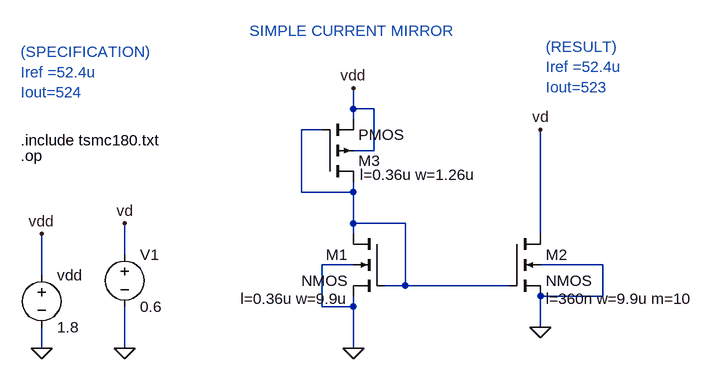
[diagram p0: schematic CurrentMirrorSimple -1.asc]
CurrentMirrorSimple -1.asc, the LTspice schematic file:
Version 4
SHEET 1 880 680
WIRE -16 0 -16 -32
WIRE 16 0 -16 0
WIRE -16 16 -16 0
WIRE -64 32 -96 32
WIRE 16 64 16 0
WIRE 16 64 -16 64
WIRE -96 128 -96 32
WIRE -16 128 -16 112
WIRE -16 128 -96 128
WIRE -16 176 -16 128
WIRE 64 176 -16 176
WIRE -16 192 -16 176
WIRE 272 192 272 32
WIRE -368 224 -368 176
WIRE -16 240 -64 240
WIRE 368 240 272 240
WIRE -496 256 -496 192
WIRE 64 272 64 176
WIRE 64 272 32 272
WIRE 224 272 64 272
WIRE 368 288 368 240
WIRE 368 288 272 288
WIRE -64 304 -64 240
WIRE -16 304 -16 288
WIRE -16 304 -64 304
WIRE 272 336 272 288
WIRE -496 368 -496 336
WIRE -368 368 -368 304
WIRE -16 368 -16 304
FLAG -16 368 0
FLAG -496 368 0
FLAG -496 192 vdd
FLAG -16 -32 vdd
FLAG 272 336 0
FLAG -368 176 vd
FLAG -368 368 0
FLAG 272 32 vd
SYMBOL nmos4 32 192 M0
WINDOW 123 56 100 Left 2
SYMATTR Value2 l=0.36u w=9.9u
SYMATTR InstName M1
SYMBOL voltage -496 240 R0
WINDOW 123 0 0 Left 0
WINDOW 39 0 0 Left 0
SYMATTR InstName vdd
SYMATTR Value 1.8
SYMBOL nmos4 224 192 R0
WINDOW 123 56 100 Left 2
SYMATTR Value2 l=360n w=9.9u m=10
SYMATTR InstName M2
SYMBOL voltage -368 208 R0
WINDOW 123 0 0 Left 0
WINDOW 39 0 0 Left 0
SYMATTR InstName V1
SYMATTR Value 0.6
SYMBOL pmos4 -64 112 M180
WINDOW 123 58 11 Left 2
SYMATTR Value2 l=0.36u w=1.26u
SYMATTR InstName M3
TEXT -528 48 Left 2 !.include tsmc180.txt
TEXT -528 72 Left 2 !.op
TEXT -176 -120 Left 2 ;SIMPLE CURRENT MIRROR
TEXT -528 -88 Left 2 ;(SPECIFICATION)\nIref =52.4u\nIout=524
TEXT 280 -96 Left 2 ;(RESULT)\nIref =52.4u\nIout=523

The netlist it stands for:
* CurrentMirrorSimple -1.asc
M1 N001 N001 0 0 NMOS l=0.36u w=9.9u
vdd vdd 0 1.8
M2 vd N001 0 0 NMOS l=360n w=9.9u m=10
V1 vd 0 0.6
M3 N001 N001 vdd vdd PMOS l=0.36u w=1.26u
.model NMOS NMOS
.model PMOS PMOS
.lib standard.mos
.include tsmc180.txt
.op
* SIMPLE CURRENT MIRROR
* (SPECIFICATION)
* Iref =52.4u
* Iout=524
* (RESULT)
* Iref =52.4u
* Iout=523
.backanno
.end